# EAGLE schematic D-DAQ Mainboard (EAGLE 6.6.0)
D-DAQ PIC32MX-controlled modular data aquisition and display
REVISION: 1
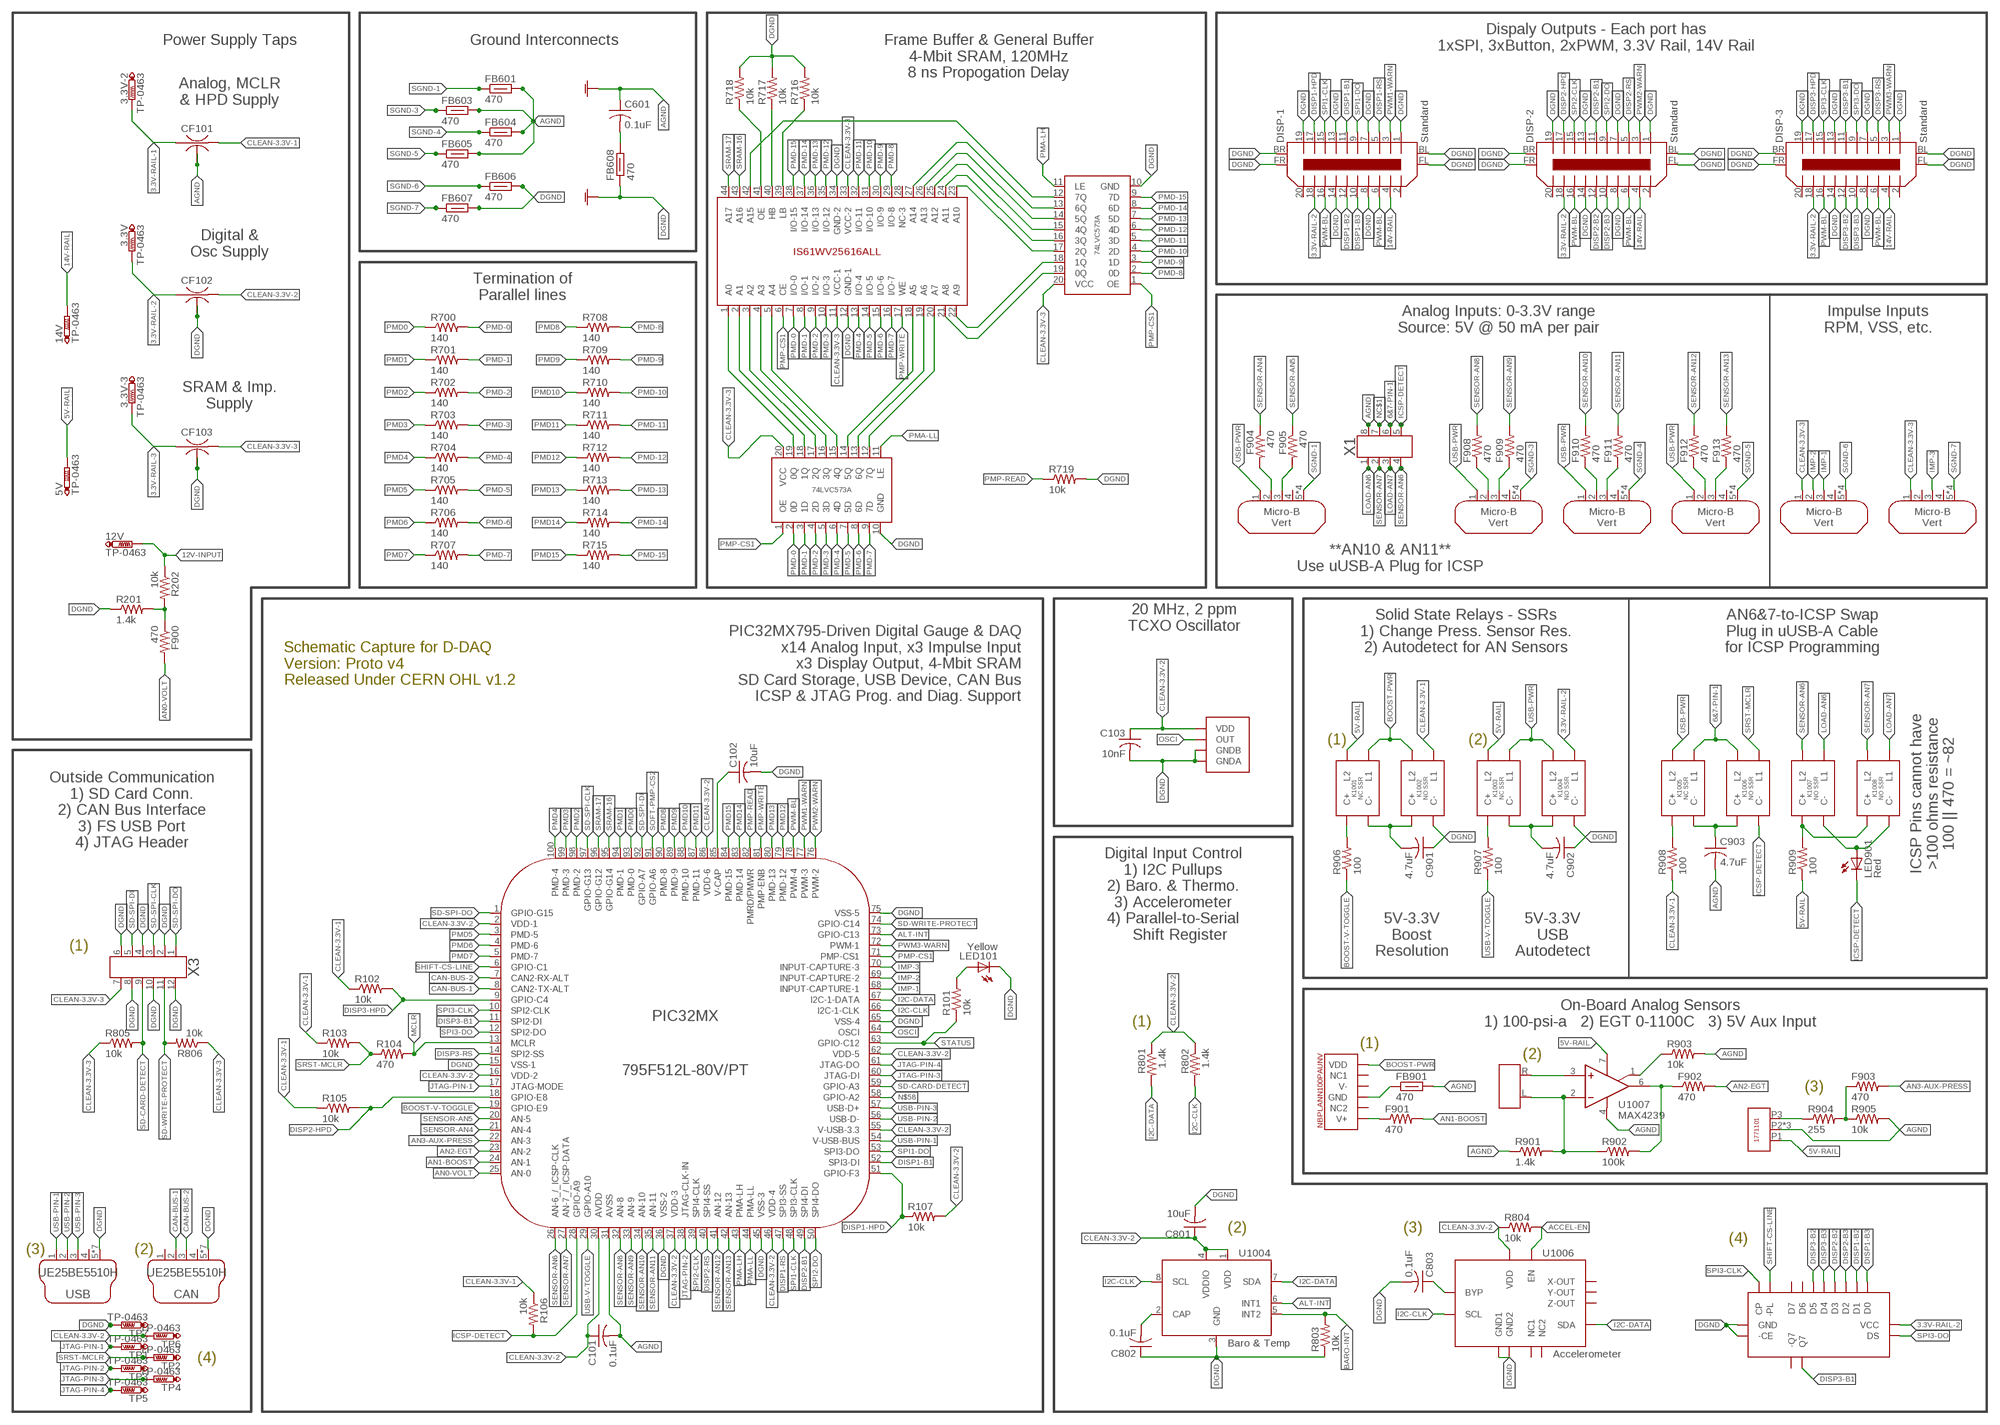
[diagram p0: schematic, sheet 1]

## Parts
3.3V  TP-0463  [TP-REC]
3.3V-2  TP-0463  [TP-REC]
3.3V-3  TP-0463  [TP-REC]
5V  TP-0463  [TP-REC]
12V  TP-0463  [TP-REC]
14V  TP-0463  [TP-REC]
AUX  PC-3-1771101  [PC-1771101]
C101  0.1uF  C-0603  [SMD-0603]
C102  10uF  C-0805  [SMD-0805]
C103  10nF  C-0603  [SMD-0603]
C601  0.1uF  C-0603  [SMD-0603]
C801  10uF  C-0805  [SMD-0805]
C802  0.1uF  C-0603  [SMD-0603]
C803  0.1uF  C-0603  [SMD-0603]
C901  4.7uF  C-0603  [SMD-0603]
C902  4.7uF  C-0603  [SMD-0603]
C903  4.7uF  C-0603  [SMD-0603]
CAN  UE25BE5510H  UE25-BE55-10H  [USB-MINI-B-VERT]
CF101  NMF21PS  [NFM21PS]
CF102  NMF21PS  [NFM21PS]
CF103  NMF21PS  [NFM21PS]
DISP-1  Standard  DP3R020SU32JQ  [JAE-MDP-STD]
DISP-2  Standard  DP3R020SU32JQ  [JAE-MDP-STD]
DISP-3  Standard  DP3R020SU32JQ  [JAE-MDP-STD]
EGT  PC-2-1702610  [PC-1702610]
F900  470  F-0603  [SMD-0603]
F901  470  F-0603  [SMD-0603]
F902  470  F-0603  [SMD-0603]
F903  470  F-0603  [SMD-0603]
F904  470  F-0603  [SMD-0603]
F905  470  F-0603  [SMD-0603]
F908  470  F-0603  [SMD-0603]
F909  470  F-0603  [SMD-0603]
F910  470  F-0603  [SMD-0603]
F911  470  F-0603  [SMD-0603]
F912  470  F-0603  [SMD-0603]
F913  470  F-0603  [SMD-0603]
FB601  470  FB-0603  [SMD-0603]
FB603  470  FB-0603  [SMD-0603]
FB604  470  FB-0603  [SMD-0603]
FB605  470  FB-0603  [SMD-0603]
FB606  470  FB-0603  [SMD-0603]
FB607  470  FB-0603  [SMD-0603]
FB608  470  FB-0603  [SMD-0603]
FB901  470  FB-0603  [SMD-0603]
IMP-1&2  Micro USB  105133-0001  [USB-MICRO-B-VERT]
IMP-3  Micro USB  105133-0001  [USB-MICRO-B-VERT]
K1001  NC SSR  CPC1117N  [SOP-4-NC]
K1002  NO SSR  CPC1017N  [SOP-4-NO]
K1003  NC SSR  CPC1117N  [SOP-4-NC]
K1004  NO SSR  CPC1017N  [SOP-4-NO]
K1005  NC SSR  CPC1117N  [SOP-4-NC]
K1006  NO SSR  CPC1017N  [SOP-4-NO]
K1007  NO SSR  CPC1017N  [SOP-4-NO]
K1008  NO SSR  CPC1017N  [SOP-4-NO]
LED101  Yellow  LED-0603  [SMD-0603]
LED901  Red  LED-0603  [SMD-0603]
MEM1001  IS61WV25616ALL  [TSOP-44]
P-4&5  Micro USB  105133-0001  [USB-MICRO-B-VERT]
P-8&9  Micro USB  105133-0001  [USB-MICRO-B-VERT]
P-10&11  Micro USB  105133-0001  [USB-MICRO-B-VERT]
P-12&13  Micro USB  105133-0001  [USB-MICRO-B-VERT]
R101  10k  R-0603  [SMD-0603]
R102  10k  R-0603  [SMD-0603]
R103  10k  R-0603  [SMD-0603]
R104  470  R-0603  [SMD-0603]
R105  10k  R-0603  [SMD-0603]
R106  10k  R-0603  [SMD-0603]
R107  10k  R-0603  [SMD-0603]
R201  1.4k  R-0603  [SMD-0603]
R202  10k  R-0603  [SMD-0603]
R700  140  R-0402  [SMD-0402]
R701  140  R-0402  [SMD-0402]
R702  140  R-0402  [SMD-0402]
R703  140  R-0402  [SMD-0402]
R704  140  R-0402  [SMD-0402]
R705  140  R-0402  [SMD-0402]
R706  140  R-0402  [SMD-0402]
R707  140  R-0402  [SMD-0402]
R708  140  R-0402  [SMD-0402]
R709  140  R-0402  [SMD-0402]
R710  140  R-0402  [SMD-0402]
R711  140  R-0402  [SMD-0402]
R712  140  R-0402  [SMD-0402]
R713  140  R-0402  [SMD-0402]
R714  140  R-0402  [SMD-0402]
R715  140  R-0402  [SMD-0402]
R716  10k  R-0603  [SMD-0603]
R717  10k  R-0603  [SMD-0603]
R718  10k  R-0603  [SMD-0603]
R719  10k  R-0603  [SMD-0603]
R801  1.4k  R-0603  [SMD-0603]
R802  1.4k  R-0603  [SMD-0603]
R803  10k  R-0603  [SMD-0603]
R804  10k  R-0603  [SMD-0603]
R805  10k  R-0603  [SMD-0603]
R806  10k  R-0603  [SMD-0603]
R901  1.4k  R-0603  [SMD-0603]
R902  100k  R-0603  [SMD-0603]
R903  10k  R-0603  [SMD-0603]
R904  255  R-0603  [SMD-0603]
R905  10k  R-0603  [SMD-0603]
R906  100  R-0603  [SMD-0603]
R907  100  R-0603  [SMD-0603]
R908  100  R-0603  [SMD-0603]
R909  100  R-0603  [SMD-0603]
TP1  TP-0463  [TP-REC]
TP2  TP-0463  [TP-REC]
TP3  TP-0463  [TP-REC]
TP4  TP-0463  [TP-REC]
TP5  TP-0463  [TP-REC]
TP6  TP-0463  [TP-REC]
TP7  TP-0463  [TP-REC]
U1001  795F512L-80V/PT  PIC32MX795F512L-80I/PF  [TQFP-100-14X14]
U1002  Octal D-Latch  74LVC573A  [TSSOP-20]
U1003  Octal D-Latch  74LVC573A  [TSSOP-20]
U1004  Baro & Temp  MPL3115A2  [LGA-8]
U1005  Boost  NBP-SENSORS  [LEADLESS-SMT]
U1006  Accelerometer  MMA8491Q  [QFN-12]
U1007  MAX4239  [SOT-8]
U1008  NXP-74HC165  [DHVQFN16]
USB  UE25BE5510H  UE25-BE55-10H  [USB-MINI-B-VERT]
X1  MOLEX-87760-0816  [MOLEX-87760-0816]
X3  MOLEX-87760-1216"  [MOLEX-87760-1216]
Y1001  XTC7009  [3.2X2.5MM]

## Nets
3.3V-RAIL-1 [power-low]: 3.3V-2.TP CF101.1
3.3V-RAIL-2 [power-low]: 3.3V.TP CF102.1 DISP-1.18 DISP-2.18 DISP-3.18 K1004.3(L1) U1008.VCC
3.3V-RAIL-3 [power-med]: 3.3V-3.TP CF103.1
5V-RAIL [analog]: 5V.TP AUX.P1 K1001.4(L2) K1003.4(L2) R909.1 U1007.7(V+)
6&7-PIN-1 [digital]: K1005.3(L1) K1006.4(L2) X1.6
12V-INPUT [analog]: 12V.TP R202.1
14V-RAIL [power-med]: 14V.TP DISP-1.4 DISP-2.4 DISP-3.4
ACCEL-BYP [digital]: C803.1 U1006.1(BYP)
ACCEL-EN [digital]: R804.2 U1006.4(EN)
ADT-1 [digital]: K1001.1(C+) R906.2
ADT-2 [digital]: K1003.1(C+) R907.2
ADT-3 [digital]: K1005.1(C+) R908.2
ADT-4 [digital]: K1007.1(C+) K1008.1(C+) R909.2
AGND [digital]: AUX.P2 AUX.T0 AUX.T1 C101.2 C601.1 C903.2 CF101.2@1 CF101.2@2 FB601.2 FB603.2 FB604.2 FB605.2 FB901.2 R901.1 R903.2 R905.2 U1001.31(AVSS) U1007.4(V-) X1.8
ALT-INT [digital]: U1001.73(GPIO-C13) U1004.6(INT1)
AN0-VOLT [digital]: F900.2 U1001.25(AN-0)
AN1-BOOST [digital]: F901.2 U1001.24(AN-1)
AN2-EGT [digital]: F902.2 U1001.23(AN-2)
AN3-AUX-PRESS [digital]: F903.2 U1001.22(AN-3)
AN4 [analog]: F904.2 P-4&5.2
AN5 [analog]: F905.2 P-4&5.3
AN8 [analog]: F908.1 P-8&9.2
AN9 [analog]: F909.1 P-8&9.3
AN10 [analog]: F910.1 P-10&11.2
AN11 [analog]: F911.1 P-10&11.3
AN12 [analog]: F912.1 P-12&13.2
AN13 [analog]: F913.1 P-12&13.3
AUX-OUT [analog]: F903.1 R904.2 R905.1
BARO-INT [digital]: R803.2 U1004.5(INT2)
BOOST-GND [digital]: FB901.1 U1005.4(GND)
BOOST-OUT [analog]: F901.1 U1005.6(V+)
BOOST-PWR [analog]: K1001.3(L1) K1002.4(L2) U1005.1(VDD)
BOOST-SSR [digital]: C901.2 K1001.2(C-) K1002.1(C+)
BOOST-V-TOGGLE [digital]: R906.1 U1001.19(GPIO-E9)
CAN-BUS-1 [digital]: CAN.2 U1001.8(CAN2-TX-ALT)
CAN-BUS-2 [digital]: CAN.3 U1001.7(CAN2-RX-ALT)
CLEAN-3.3V-1 [power-low]: CF101.3 K1002.3(L1) R102.1 R103.1 R105.1 R106.1 R908.1
CLEAN-3.3V-2 [analog]: C101.1 C103.1 C801.1 CF102.3 R107.2 R801.1 R802.1 R804.1 TP6.TP U1001.2(VDD-1) U1001.16(VDD-2) U1001.30(AVDD) U1001.37(VDD-3) U1001.46(VDD-4) U1001.55(V-USB-3.3) U1001.62(VDD-5) U1001.86(VDD-6) U1004.1(VDD) U1004.4(VDDIO) U1006.2(VDD) Y1001.P$4(VDD)
CLEAN-3.3V-3 [power-low]: CF103.3 IMP-1&2.1 IMP-3.1 MEM1001.11(VCC-1) MEM1001.33(VCC-2) R805.1 R806.1 U1002.20(VCC) U1003.20(VCC) X3.7
DGND [digital]: C102.2 C103.2 C801.2 C802.1 C803.2 C901.1 C902.1 CAN.5 CAN.P$1 CAN.P$2 CAN.P$3 CAN.P$4 CAN.T0 CAN.T1 CF102.2@1 CF102.2@2 CF103.2@1 CF103.2@2 DISP-1.1 DISP-1.7 DISP-1.8 DISP-1.13 DISP-1.14 DISP-1.19 DISP-1.BL DISP-1.BR DISP-1.FL DISP-1.FR DISP-2.1 DISP-2.7 DISP-2.8 DISP-2.13 DISP-2.14 DISP-2.19 DISP-2.BL DISP-2.BR DISP-2.FL DISP-2.FR DISP-3.1 DISP-3.7 DISP-3.8 DISP-3.13 DISP-3.14 DISP-3.19 DISP-3.BL DISP-3.BR DISP-3.FL DISP-3.FR FB606.2 FB607.2 FB608.1 K1002.2(C-) K1004.2(C-) LED101.2 MEM1001.12(GND-1) MEM1001.34(GND-2) R201.1 R716.2 R717.2 R718.2 R719.2 R803.1 TP7.TP U1001.15(VSS-1) U1001.36(VSS-2) U1001.45(VSS-3) U1001.65(VSS-4) U1001.75(VSS-5) U1002.10(GND) U1003.10(GND) U1004.3(GND) U1006.6(GND1) U1006.7(GND2) U1008.-CE U1008.GND U1008.GND2(GND) USB.5 USB.P$1 USB.P$2 USB.P$3 USB.P$4 USB.T0 USB.T1 X3.2 X3.4 X3.6 X3.8 X3.10 X3.12 Y1001.P$1(GNDA) Y1001.P$2(GNDB)
DISP1-B1 [digital]: DISP-1.11 U1001.52(SPI3-DI)
DISP1-B2 [digital]: DISP-1.12 U1008.D1
DISP1-B3 [digital]: DISP-1.10 U1008.D0
DISP1-HPD [digital]: DISP-1.17 R107.1 U1001.51(GPIO-F3)
DISP1-RS [digital]: DISP-1.5 U1001.47(SPI3-SS)
DISP2-B1 [digital]: DISP-2.11 U1001.49(SPI4-DI)
DISP2-B2 [digital]: DISP-2.12 U1008.D3
DISP2-B3 [digital]: DISP-2.10 U1008.D2
DISP2-HPD [digital]: DISP-2.17 R105.2 U1001.18(GPIO-E8)
DISP2-RS [digital]: DISP-2.5 U1001.40(SPI4-SS)
DISP3-B1 [digital]: DISP-3.11 U1001.11(SPI2-DI) U1008.Q7
DISP3-B2 [digital]: DISP-3.12 U1008.D5
DISP3-B3 [digital]: DISP-3.10 U1008.D4
DISP3-HPD [digital]: DISP-3.17 R102.2 U1001.9(GPIO-C4)
DISP3-RS [digital]: DISP-3.5 U1001.14(SPI2-SS)
EGT-NEG-IN [analog]: EGT.L R901.2 R902.1 U1007.2(-IN)
EGT-OUT [analog]: F902.1 R902.2 U1007.6(OUT1)
EGT-POS-IN [power-low]: EGT.R U1007.3(+IN)
EGT-SHDN [analog]: R903.1 U1007.1(CRETN)
GND-FILTER [power-med]: C601.2 FB608.2
HB-PD [digital]: MEM1001.40(HB) R717.1
I2C-CLK [digital]: R802.2 U1001.66(I2C-1-CLK) U1004.8(SCL) U1006.5(SCL)
I2C-DATA [digital]: R801.2 U1001.67(I2C-1-DATA) U1004.7(SDA) U1006.3(SDA)
ICSP-DETECT [digital]: K1006.2(C-) LED901.2 R106.2 U1001.28(GPIO-A9) X1.5
ICSP-LED [digital]: K1007.2(C-) K1008.2(C-) LED901.1
ICSP-SSR [digital]: C903.1 K1005.2(C-) K1006.1(C+)
IMP-1 [digital]: IMP-1&2.3 U1001.68(INPUT-CAPTURE-1)
IMP-2 [digital]: IMP-1&2.2 U1001.69(INPUT-CAPTURE-2)
IMP-3 [digital]: IMP-3.3 U1001.70(INPUT-CAPTURE-3)
INPUT-V-SENSE [analog]: F900.1 R201.2 R202.2
JTAG-PIN-1 [digital]: TP1.TP U1001.17(JTAG-MODE)
JTAG-PIN-2 [digital]: TP3.TP U1001.38(JTAG-CLK-IN)
JTAG-PIN-3 [digital]: TP4.TP U1001.60(JTAG-DI)
JTAG-PIN-4 [digital]: TP5.TP U1001.61(JTAG-DO)
LB-PD [digital]: MEM1001.39(LB) R716.1
LOAD-AN6 [analog]: K1007.3(L1) X1.1
LOAD-AN7 [analog]: K1008.3(L1) X1.3
MCLR [digital]: R104.2 U1001.13(MCLR)
MPL-BYP-CAP [analog]: C802.2 U1004.2(CAP)
N$58: U1001.58(GPIO-A2)
NC$1: X1.7
OE-PD [digital]: MEM1001.41(OE) R718.1
OIL-PRESS-OUT [digital]: AUX.P3 R904.1
OSCI [digital]: U1001.64(OSCI) Y1001.P$3(OUT)
PMA-LH [digital]: U1001.43(PMA-LH) U1003.11(LE)
PMA-LL [digital]: U1001.44(PMA-LL) U1002.11(LE)
PMD0 [digital]: R700.1 U1001.93(PMD-0)
PMD1 [digital]: R701.1 U1001.94(PMD-1)
PMD2 [digital]: R702.1 U1001.98(PMD-2)
PMD3 [digital]: R703.1 U1001.99(PMD-3)
PMD4 [digital]: R704.1 U1001.100(PMD-4)
PMD5 [digital]: R705.1 U1001.3(PMD-5)
PMD6 [digital]: R706.1 U1001.4(PMD-6)
PMD7 [digital]: R707.1 U1001.5(PMD-7)
PMD8 [digital]: R708.1 U1001.90(PMD-8)
PMD9 [digital]: R709.1 U1001.89(PMD-9)
PMD10 [digital]: R710.1 U1001.88(PMD-10)
PMD11 [digital]: R711.1 U1001.87(PMD-11)
PMD12 [digital]: R712.1 U1001.79(PMD-12)
PMD13 [digital]: R713.1 U1001.80(PMD-13)
PMD14 [digital]: R714.1 U1001.83(PMD-14)
PMD15 [digital]: R715.1 U1001.84(PMD-15)
PMD-0 [digital]: MEM1001.7(I/O-0) R700.2 U1002.2(0D)
PMD-1 [digital]: MEM1001.8(I/O-1) R701.2 U1002.3(1D)
PMD-2 [digital]: MEM1001.9(I/O-2) R702.2 U1002.4(2D)
PMD-3 [digital]: MEM1001.10(I/O-3) R703.2 U1002.5(3D)
PMD-4 [digital]: MEM1001.13(I/O-4) R704.2 U1002.6(4D)
PMD-5 [digital]: MEM1001.14(I/O-5) R705.2 U1002.7(5D)
PMD-6 [digital]: MEM1001.15(I/O-6) R706.2 U1002.8(6D)
PMD-7 [digital]: MEM1001.16(I/O-7) R707.2 U1002.9(7D)
PMD-8 [digital]: MEM1001.29(I/O-8) R708.2 U1003.2(0D)
PMD-9 [digital]: MEM1001.30(I/O-9) R709.2 U1003.3(1D)
PMD-10 [digital]: MEM1001.31(I/O-10) R710.2 U1003.4(2D)
PMD-11 [digital]: MEM1001.32(I/O-11) R711.2 U1003.5(3D)
PMD-12 [digital]: MEM1001.35(I/O-12) R712.2 U1003.6(4D)
PMD-13 [digital]: MEM1001.36(I/O-13) R713.2 U1003.7(5D)
PMD-14 [digital]: MEM1001.37(I/O-14) R714.2 U1003.8(6D)
PMD-15 [digital]: MEM1001.38(I/O-15) R715.2 U1003.9(7D)
PMP-CS1 [digital]: MEM1001.6(CE) U1001.71(PMP-CS1) U1002.1(OE) U1003.1(OE)
PMP-READ [digital]: R719.1 U1001.82(PMRD/PMWR)
PMP-WRITE [digital]: MEM1001.17(WE) U1001.81(PMP-ENB)
PWM1-WARN [digital]: DISP-1.3 U1001.77(PWM-3)
PWM2-WARN [digital]: DISP-2.3 U1001.76(PWM-2)
PWM3-WARN [digital]: DISP-3.3 U1001.72(PWM-1)
PWM-BL [digital]: DISP-1.6 DISP-1.16 DISP-2.6 DISP-2.16 DISP-3.6 DISP-3.16 U1001.78(PWM-4)
SD-CARD-DETECT [digital]: R805.2 U1001.59(GPIO-A3) X3.9
SD-SPI-CLK [digital]: U1001.97(GPIO-G13) X3.3
SD-SPI-DI [digital]: U1001.92(GPIO-A7) X3.5
SD-SPI-DO [digital]: U1001.1(GPIO-G15) X3.1
SD-WRITE-PROTECT [digital]: R806.2 U1001.74(GPIO-C14) X3.11
SENSOR-AN4 [digital]: F904.1 U1001.21(AN-4)
SENSOR-AN5 [digital]: F905.1 U1001.20(AN-5)
SENSOR-AN6 [analog]: K1007.4(L2) U1001.26(AN-6_/_ICSP-CLK) X1.4
SENSOR-AN7 [analog]: K1008.4(L2) U1001.27(AN-7_/_ICSP-DATA) X1.2
SENSOR-AN8 [digital]: F908.2 U1001.32(AN-8)
SENSOR-AN9 [digital]: F909.2 U1001.33(AN-9)
SENSOR-AN10 [digital]: F910.2 U1001.34(AN-10)
SENSOR-AN11 [digital]: F911.2 U1001.35(AN-11)
SENSOR-AN12 [digital]: F912.2 U1001.41(AN-12)
SENSOR-AN13 [digital]: F913.2 U1001.42(AN-13)
SGND-1 [digital]: FB601.1 P-4&5.5 P-4&5.T0 P-4&5.T1 P-4&5.T2
SGND-3 [digital]: FB603.1 P-8&9.5 P-8&9.T0 P-8&9.T1 P-8&9.T2
SGND-4 [digital]: FB604.1 P-10&11.5 P-10&11.T0 P-10&11.T1 P-10&11.T2
SGND-5 [digital]: FB605.1 P-12&13.5 P-12&13.T0 P-12&13.T1 P-12&13.T2
SGND-6 [digital]: FB606.1 IMP-1&2.5 IMP-1&2.T0 IMP-1&2.T1 IMP-1&2.T2
SGND-7 [digital]: FB607.1 IMP-3.5 IMP-3.T0 IMP-3.T1 IMP-3.T2
SHIFT-CS-LINE [digital]: U1001.6(GPIO-C1) U1008.-PL
SOFT-PMP-CS2 [digital]: U1001.91(GPIO-A6)
SPI1-CLK [digital]: DISP-1.15 U1001.48(SPI3-CLK)
SPI1-DO [digital]: DISP-1.9 U1001.53(SPI3-DO)
SPI2-CLK [digital]: DISP-2.15 U1001.39(SPI4-CLK)
SPI2-DO [digital]: DISP-2.9 U1001.50(SPI4-DO)
SPI3-CLK [digital]: DISP-3.15 U1001.10(SPI2-CLK) U1008.CP
SPI3-DO [digital]: DISP-3.9 U1001.12(SPI2-DO) U1008.DS
SRAM-0 [digital]: MEM1001.1(A0) U1002.19(0Q)
SRAM-1 [digital]: MEM1001.2(A1) U1002.18(1Q)
SRAM-2 [digital]: MEM1001.3(A2) U1002.17(2Q)
SRAM-3 [digital]: MEM1001.4(A3) U1002.16(3Q)
SRAM-4 [digital]: MEM1001.5(A4) U1002.15(4Q)
SRAM-5 [digital]: MEM1001.18(A5) U1002.14(5Q)
SRAM-6 [digital]: MEM1001.19(A6) U1002.13(6Q)
SRAM-7 [digital]: MEM1001.20(A7) U1002.12(7Q)
SRAM-8 [digital]: MEM1001.21(A8) U1003.19(0Q)
SRAM-9 [digital]: MEM1001.22(A9) U1003.18(1Q)
SRAM-10 [digital]: MEM1001.23(A10) U1003.17(2Q)
SRAM-11 [digital]: MEM1001.24(A11) U1003.16(3Q)
SRAM-12 [digital]: MEM1001.25(A12) U1003.15(4Q)
SRAM-13 [digital]: MEM1001.26(A13) U1003.14(5Q)
SRAM-14 [digital]: MEM1001.27(A14) U1003.13(6Q)
SRAM-15 [digital]: MEM1001.42(A15) U1003.12(7Q)
SRAM-16 [digital]: MEM1001.43(A16) U1001.95(GPIO-G14)
SRAM-17 [digital]: MEM1001.44(A17) U1001.96(GPIO-G12)
SRST-MCLR [digital]: K1006.3(L1) R103.2 R104.1 TP2.TP
STATUS [digital]: R101.1 U1001.63(GPIO-C12)
STATUS-LED [digital]: LED101.1 R101.2
USB-PIN-1 [digital]: U1001.54(V-USB-BUS) USB.1
USB-PIN-2 [digital]: U1001.56(USB-D-) USB.2
USB-PIN-3 [digital]: U1001.57(USB-D+) USB.3
USB-PWR [analog]: K1003.3(L1) K1004.4(L2) K1005.4(L2) P-4&5.1 P-8&9.1 P-10&11.1 P-12&13.1
USB-SSR [digital]: C902.2 K1003.2(C-) K1004.1(C+)
USB-V-TOGGLE [digital]: R907.1 U1001.29(GPIO-A10)
V-CAP: C102.1 U1001.85(V-CAP)
Unconnected: CAN.4 DISP-1.2 DISP-1.20 DISP-2.2 DISP-2.20 DISP-3.2 DISP-3.20 IMP-1&2.4 IMP-3.2 IMP-3.4 MEM1001.28(NC-3) P-4&5.4 P-8&9.4 P-10&11.4 P-12&13.4 U1005.2(NC1) U1005.3(V-) U1005.5(NC2) U1006.8(Z-OUT) U1006.9(Y-OUT) U1006.10(X-OUT) U1006.11(NC1) U1006.12(NC2) U1008.-Q7 U1008.D6 U1008.D7 USB.4

## Notes on the sheet
- Dispaly Outputs - Each port has
  1xSPI, 3xButton, 2xPWM, 3.3V Rail, 14V Rail
- Power Supply Taps | Ground Interconnects
- Frame Buffer & General Buffer
  4-Mbit SRAM, 120MHz
  8 ns Propogation Delay
- Analog, MCLR
  & HPD Supply
- Digital &
  Osc Supply
- Termination of
  Parallel lines
- Analog Inputs: 0-3.3V range
  Source: 5V @ 50 mA per pair
- Impulse Inputs
  RPM, VSS, etc.
- SRAM & Imp.
  Supply
- **AN10 & AN11**
  Use uUSB-A Plug for ICSP
- Solid State Relays - SSRs
  1) Change Press. Sensor Res.
  2) Autodetect for AN Sensors
- AN6&7-to-ICSP Swap
  Plug in uUSB-A Cable
  for ICSP Programming
- 20 MHz, 2 ppm
  TCXO Oscillator
- Schematic Capture for D-DAQ
  Version: Proto v4
  Released Under CERN OHL v1.2
- PIC32MX795-Driven Digital Gauge & DAQ
  x14 Analog Input, x3 Impulse Input
  x3 Display Output, 4-Mbit SRAM
  SD Card Storage, USB Device, CAN Bus
  ICSP & JTAG Prog. and Diag. Support
- (1) | (2)
- Outside Communication
  1) SD Card Conn.
  2) CAN Bus Interface
  3) FS USB Port
  4) JTAG Header
- ICSP Pins cannot have
  >100 ohms resistance
  100 || 470 = ~82
- Digital Input Control
  1) I2C Pullups
  2) Baro. & Thermo.
  3) Accelerometer
  4) Parallel-to-Serial
     Shift Register
- 5V-3.3V
  Boost
  Resolution
- 5V-3.3V
  USB
  Autodetect
- (1)
- On-Board Analog Sensors
  1) 100-psi-a   2) EGT 0-1100C   3) 5V Aux Input
- (1)
- (1)
- (2)
- (3)
- (2) | (3)
- (4)
- (3) | (2)
- (4)

## Power pins joined to a net without a drawn wire
P$1: CAN.1

## Library data of the parts
3.3V 3.3V-2 3.3V-3 5V 12V 14V TP1-TP7 = Parts for D-DAQ:TP-
AUX = Parts for D-DAQ:PC-3-: Phoenix Contact's 3-Terminal Terminal Blocks
C101-C103 C601 C801-C803 C901-C903 = Parts for D-DAQ:C-: Capacitor
CAN USB = Parts for D-DAQ:UE25-BE55-10H: Vertical Mini USB Type-B
CF101-CF103 = Parts for D-DAQ:NMF21PS
DISP-1-DISP-3 = Parts for D-DAQ:DP3R020?U32JQ: JAE Mini DisplayPort, aka Thunderbolt; ORIENTATION: Standard
EGT = Parts for D-DAQ:PC-2-: Phoenix Contact's 2-wire Terminal Blocks
F900-F905 F908-F913 = Parts for D-DAQ:F-
FB601 FB603-FB608 FB901 = Parts for D-DAQ:FB-
IMP-1&2 IMP-3 P-4&5 P-8&9 P-10&11 P-12&13 = Parts for D-DAQ:105133-0001: Molex Micro-B receptical, perpendicular to board
K1001-K1008 = Parts for D-DAQ:CPC1?17N: 150 mA Load Solid State Relay CPC1117 is a NC, Normally Closed, Form-B Relay CPC1017 is a NO, Normally Open, Form-A Relay
LED101 LED901 = Parts for D-DAQ:LED-
MEM1001 = Parts for D-DAQ:IS61WV25616ALL
R101-R107 R201 R202 R700-R719 R801-R806 R901-R909 = Parts for D-DAQ:R-: Resistor
U1001 = Parts for D-DAQ:PIC32MX795F512L-80I/P: PIC32MX795 Microcontroller
U1002 U1003 = Parts for D-DAQ:74LVC573A: 74LVC573A, 8.5 ns @ 3.3 V Octal Transparent D-type latch
U1004 = Parts for D-DAQ:MPL3115A2: I2C Barometric Pressure & Ambient Temperature sensor
U1005 = Parts for D-DAQ:NBP-SENSORS: Boost Pressure sensor
U1006 = Parts for D-DAQ:MMA8491Q: Digital Accelerometer: 3-axis, 12-bit
U1007 = Parts for D-DAQ:MAX4239: High Precision & Accuracy OP Amp
U1008 = Parts for D-DAQ:NXP-74HC165
X1 = Parts for D-DAQ:MOLEX-87760-0816
X3 = Parts for D-DAQ:MOLEX-87760-1216: 12-pin Header, Right Angle
Y1001 = Parts for D-DAQ:XTC7009: 16.368 MEMS Oscillator 0.2 ppm, -30˚C to 85˚C

## Net classes
0 min: width 0.152 mm, drill 0.33 mm, clearance 0.152 mm
1 analog: width 0.254 mm, drill 0.381 mm, clearance 0.203 mm
2 digital: width 0.203 mm, drill 0.381 mm, clearance 0.203 mm
3 power-low: width 0.305 mm, drill 0.381 mm, clearance 0.254 mm
4 power-med: width 0.508 mm, drill 0.508 mm, clearance 0.254 mm
5 power-hi: width 0.635 mm, drill 0.635 mm, clearance 0.381 mm